# EAGLE schematic GrooveStrip (EAGLE 9.6.0)
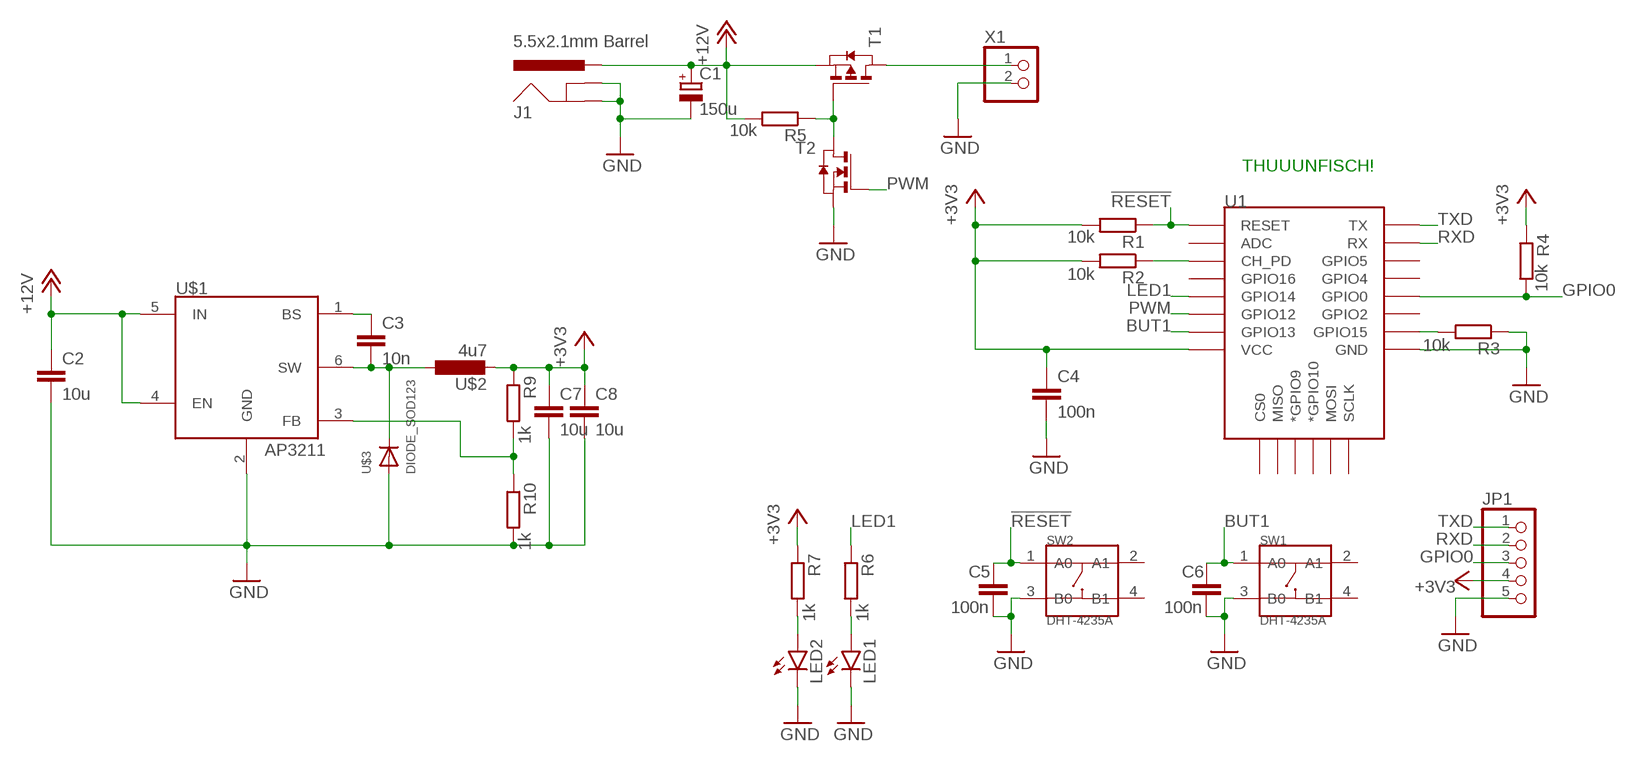
[diagram p0: schematic, sheet 1]

## Parts
C1  150u  CPOL-EUD  [PANASONIC_D]
C2  10u  C-EUC0805  [C0805]
C3  10n  C-EUC0805  [C0805]
C4  100n  C-EUC0805  [C0805]
C5  100n  C-EUC0805  [C0805]
C6  100n  C-EUC0805  [C0805]
C7  10u  C-EUC0805  [C0805]
C8  10u  C-EUC0805  [C0805]
J1  5.5x2.1mm Barrel  POWER_JACKSMD  [POWER_JACK_SMD]
JP1  PINHD-1X5  [1X05]
LED1  LEDCHIPLED_0805  [CHIPLED_0805]
LED2  LEDCHIPLED_0805  [CHIPLED_0805]
R1  10k  R-EU_R0805  [R0805]
R2  10k  R-EU_R0805  [R0805]
R3  10k  R-EU_R0805  [R0805]
R4  10k  R-EU_R0805  [R0805]
R5  10k  R-EU_R0805  [R0805]
R6  1k  R-EU_R0805  [R0805]
R7  1k  R-EU_R0805  [R0805]
R9  1k  R-EU_R0805  [R0805]
R10  1k  R-EU_R0805  [R0805]
SW1  DHT-4235A  SMD-BUTTON-TOP-DHT-4235A(4P-4.2X3.2MM)  [SW4-SMD-4.2X3.2X2.5MM]
SW2  DHT-4235A  SMD-BUTTON-TOP-DHT-4235A(4P-4.2X3.2MM)  [SW4-SMD-4.2X3.2X2.5MM]
T1  PMOSSOT23  [SOT23-3]
T2  NMOSSOT23  [SOT23-3]
U1  ESP12ESMD  [ESP12E-SMD]
U$1  AP3211  [SOT23-6]
U$2  4u7  SRN5020  [SRN5020]
U$3  DIODE_SOD123  [SOD-123]
X1  W237-102  [SCREW_2P]

## Nets
!RESET: C5.1 R1.1 SW2.1(A0) U1.RESET
+3V3: C4.1 C7.1 C8.1 JP1.4 R1.2 R2.2 R4.1 R7.1 R9.1 U1.VCC U$2.P$2
+12V: C1.+ C2.1 J1.VIN0(PWR) R5.2 T1.2(S) U$1.4(EN) U$1.5(IN)
BUT1: C6.1 SW1.1(A0) U1.GPIO13
GND: C1.- C2.2 C4.2 C5.2 C6.2 C7.2 C8.2 J1.GND(GNDBREAK) J1.P$4(GND) JP1.5 LED1.C LED2.C R3.1 R10.2 SW1.3(B0) SW2.3(B0) T2.2(S) U1.GND U$1.2(GND) U$3.A X1.2
GPIO0: JP1.3 R4.2 U1.GPIO0
LED1: R6.1 U1.GPIO14
N$1: T1.1(D) X1.1
N$2: R2.1 U1.CH_PD
N$3: R9.2 R10.1 U$1.3(FB)
N$4: R3.2 U1.GPIO15
N$5: R5.1 T1.3(G) T2.1(D)
N$6: LED1.A R6.2
N$7: LED2.A R7.2
N$10: C3.2 U$1.6(SW) U$2.P$1 U$3.C
N$11: C3.1 U$1.1(BS)
PWM: T2.3(G) U1.GPIO12
RXD: JP1.2 U1.RXD0(RX)
TXD: JP1.1 U1.TXD0(TX)
Unconnected: SW1.2(A1) SW1.4(B1) SW2.2(A1) SW2.4(B1) U1.ADC U1.CS0 U1.GPIO2 U1.GPIO4 U1.GPIO5 U1.GPIO9(*GPIO9) U1.GPIO10(*GPIO10) U1.GPIO16 U1.MISO U1.MOSI U1.SCLK

## Notes on the sheet
- THUUUNFISCH!

## Library data of the parts
C1 = rcl:CPOL-EU: POLARIZED CAPACITOR, European symbol; SPICEPREFIX: C
C2-C8 = rcl:C-EU: CAPACITOR, European symbol; SPICEPREFIX: C
J1 = philmalessa:POWER_JACK: Power Jack Connector This is the standard 5.5mm barrel jack for power. The PTH is the most common, proven, reliable, footprint. The Slot footprint only works if the mill layer is transmitted to the PCB fab house so be warned. Here are the connectors we sell at SparkFun: DC Barrel Power Jack/Connector <https://www.sparkfun.com/products/119> (PRT-00119) DC Barrel Power Jack/Connector (SMD) <https://www.sparkfun.com/products/12748> (PRT-12748) DC Barrel Jack Adapter - Breadboard Compatible <https://www.sparkfun.com/products/10811> (PRT-10811) It is used on this SparkFun product (and many, many others): SparkFun RedBoard - Programmed with Arduino <https://www.sparkfun.com/products/12757> (DEV-12757) Also, if you need a mating power supply or connector, please check these out: Wall Adapter Power Supply - 9VDC 650mA <https://www.sparkfun.com/products/298> (TOL-00298) DC Barrel Jack Adapter - Male <https://www.sparkfun.com/products/10287> (PRT-10287); PROD_ID: CONN-08106; SF_ID: PRT-12748
JP1 = pinhead:PINHD-1X5: PIN HEADER
LED1 LED2 = led:LED: LED OSRAM: - CHIPLED LG R971, LG N971, LY N971, LG Q971, LY Q971, LO R971, LY R971 LH N974, LH R974 LS Q976, LO Q976, LY Q976 LO Q996 - Hyper CHIPLED LW Q18S LB Q993, LB Q99A, LB R99A - SideLED LS A670, LO A670, LY A670, LG A670, LP A670 LB A673, LV A673, LT A673, LW A673 LH A674 LY A675 LS A676, LA A676, LO A676, LY A676, LW A676 LS A679, LY A679, LG A679 - Hyper Micro SIDELED® LS Y876, LA Y876, LO Y876, LY Y876 LT Y87S - SmartLED LW L88C, LW L88S LB L89C, LB L89S, LG L890 LS L89K, LO L89K, LY L89K LS L896, LA L896, LO L896, LY L896 - TOPLED LS T670, LO T670, LY T670, LG T670, LP T670 LSG T670, LSP T670, LSY T670, LOP T670, LYG T670 LG T671, LOG T671, LSG T671 LB T673, LV T673, LT T673, LW T673 LH T674 LS T676, LA T676, LO T676, LY T676, LB T676, LH T676, LSB T676, LW T676 LB T67C, LV T67C, LT T67C, LS T67K, LO T67K, LY T67K, LW E67C LS E67B, LA E67B, LO E67B, LY E67B, LB E67C, LV E67C, LT E67C LW T67C LS T679, LY T679, LG T679 LS T770, LO T770, LY T770, LG T770, LP T770 LB T773, LV T773, LT T773, LW T773 LH T774 LS E675, LA E675, LY E675, LS T675 LS T776, LA T776, LO T776, LY T776, LB T776 LHGB T686 LT T68C, LB T68C - Hyper Mini TOPLED® LB M676 - Mini TOPLED Santana® LG M470 LS M47K, LO M47K, LY M47K Source: http://www.osram.convergy.de LUXEON: - LUMILED® LXK2-PW12-R00, LXK2-PW12-S00, LXK2-PW14-U00, LXK2-PW14-V00 LXK2-PM12-R00, LXK2-PM12-S00, LXK2-PM14-U00 LXK2-PE12-Q00, LXK2-PE12-R00, LXK2-PE12-S00, LXK2-PE14-T00, LXK2-PE14-U00 LXK2-PB12-K00, LXK2-PB12-L00, LXK2-PB12-M00, LXK2-PB14-N00, LXK2-PB14-P00, LXK2-PB14-Q00 LXK2-PR12-L00, LXK2-PR12-M00, LXK2-PR14-Q00, LXK2-PR14-R00 LXK2-PD12-Q00, LXK2-PD12-R00, LXK2-PD12-S00 LXK2-PH12-R00, LXK2-PH12-S00 LXK2-PL12-P00, LXK2-PL12-Q00, LXK2-PL12-R00 Source: www.luxeon.com KINGBRIGHT: KA-3528ASYC Source: www.kingbright.com
R1-R7 R9 R10 = rcl:R-EU_: RESISTOR, European symbol; SPICEPREFIX: R
SW1 SW2 = philmalessa:SMD-BUTTON-TOP-DHT-4235A(4P-4.2X3.2MM): 311020045; MPN: DHT-4235A
T1 = philmalessa:PMOSSOT23: MOS FET
T2 = philmalessa:NMOSSOT23: MOS FET
U1 = philmalessa:ESP12E: ESP12E Module
U$1 = philmalessa:AP3211
U$2 = philmalessa:SRN5020
U$3 = philmalessa:DIODE_SOD123
X1 = philmalessa:W237-102: WAGO SCREW CLAMP; MPN: 237-102; OC_FARNELL: unknown; OC_NEWARK: 70K9898